# EAGLE design Xenon_Light (EAGLE 8.0.1)
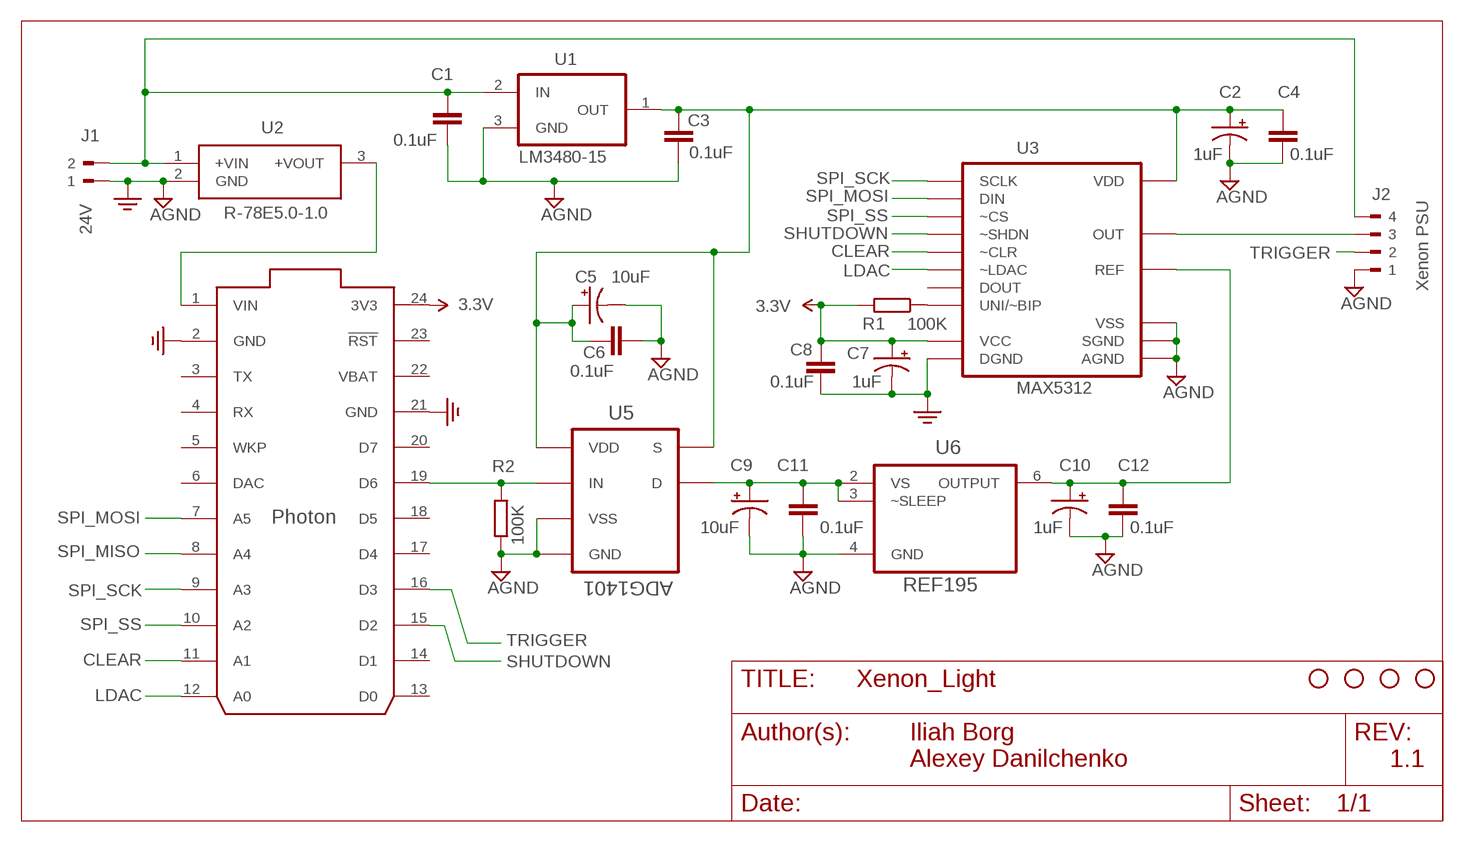
[diagram p0: schematic, sheet 1]

## Parts
C1  0.1uF  C-EUC0805  [C0805]
C2  1uF  TANT-CAP1206  [EIA3216]
C3  0.1uF  C-EUC0805  [C0805]
C4  0.1uF  C-EUC0805  [C0805]
C5  10uF  TANT-CAP1206  [EIA3216]
C6  0.1uF  C-EUC0805  [C0805]
C7  1uF  TANT-CAP1206  [EIA3216]
C8  0.1uF  C-EUC0805  [C0805]
C9  10uF  TANT-CAP1206  [EIA3216]
C10  1uF  TANT-CAP1206  [EIA3216]
C11  0.1uF  C-EUC0805  [C0805]
C12  0.1uF  C-EUC0805  [C0805]
J1  24V  PM5.08/2/90BLK  [WEIDMULLER_PM5.08_2]
J2  Xenon PSU  TERMINAL_BLK_4  [TERMINAL_BLK_4X5MM]
R1  100K  R-EU_R0805  [R0805]
R2  100K  R-EU_R0805  [R0805]
STANDOFF1  STAND-OFF  [STAND-OFF]
STANDOFF2  STAND-OFF  [STAND-OFF]
STANDOFF3  STAND-OFF  [STAND-OFF]
STANDOFF4  STAND-OFF  [STAND-OFF]
U1  LM3480-15  LM3480  [SOT23]
U2  R-78E5.0-1.0  [R-78E5.0-1.0]
U3  MAX5312  [SSOP16]
U4  PHOTON_WITH_HEADERS  [PHOTON]
U5  ADG1401  ADG1401BRMZ  [SOP65P490X110-8N]
U6  REF195  [SOIC127P600X175-8N]

## Nets
3.3V: C7.A(+) C8.2 R1.2 U3.6(VCC) U4.24(3V3)
15V: C9.A(+) C11.2 U5.8(D) U6.2(VS) U6.3(~SLEEP)
CLEAR: U3.15(~CLR) U4.11(A1)
GND: C1.1 C2.C(-) C3.1 C4.1 C5.C(-) C6.1 C7.C(-) C8.1 C9.C(-) C10.C(-) C11.1 C12.1 J1.1 J2.1 R2.1 U1.3(GND) U2.2(GND) U3.5(DGND) U3.10(SGND) U3.11(AGND) U3.12(VSS) U4.2(GND) U4.21(GND) U5.3(GND) U5.7(VSS) U6.4(GND) ; supply symbol labelled AGND
LDAC: U3.16(~LDAC) U4.12(A0)
N$1: C1.2 J1.2 J2.4 U1.2(IN) U2.1(+VIN)
N$2: U2.3(+VOUT) U4.1(VIN)
N$3: R2.2 U4.19(D6) U5.6(IN)
N$5: R1.1 U3.8(UNI/~BIP)
N$6: J2.3 U3.9(OUT)
REF: C10.A(+) C12.2 U3.13(REF) U6.6(OUTPUT)
SHUTDOWN: U3.7(~SHDN) U4.15(D2)
SPI_MISO: U4.8(A4)
SPI_MOSI: U3.2(DIN) U4.7(A5)
SPI_SCK: U3.1(SCLK) U4.9(A3)
SPI_SS: U3.3(~CS) U4.10(A2)
TRIGGER: J2.2 U4.16(D3)
V15V: C2.A(+) C3.2 C4.2 C5.A(+) C6.2 U1.1(OUT) U3.14(VDD) U5.1(S) U5.4(VDD)
Unconnected: U3.4(DOUT) U4.3(TX) U4.4(RX) U4.5(WKP) U4.6(DAC) U4.13(D0) U4.14(D1) U4.17(D4) U4.18(D5) U4.20(D7) U4.23(!RST)

## Notes on the sheet
- Iliah Borg
  Alexey Danilchenko
- 1.1

## Power pins joined to a net without a drawn wire
VBAT: U4.22(VBAT)

## Library data of the parts
C1 C3 C4 C6 C8 C11 C12 = resistor:C-EU: CAPACITOR, European symbol
C2 C7 C10 = Spectron:TANT-CAP: Tantalum SMT
C5 C9 = Spectron2:TANT-CAP: Tantalum SMT
J1 = WEIDMULLER-PM5.08_2_90BLK:PM5.08/2/90BLK: TERMINAL BLOCK, SIDE ENTRY, 2WAY; MPN: PM5.08/2/90 BLK; OC_FARNELL: 1131855; OC_NEWARK: 26M1980; PACKAGE: TH-R/A; SUPPLIER: WEIDMULLER
J2 = WEIDMULLER-PM5.08_2_90BLK:TERMINAL_BLK_4: TERMINAL BLOCK, SIDE ENTRY, 2WAY
R1 R2 = rcl:R-EU_: RESISTOR, European symbol
STANDOFF1-STANDOFF4 = Spectron2:STAND-OFF: #4 Stand Off This is the mechanical footprint for a #4 phillips button head screw. Use the keepout ring to avoid running the screw head into surrounding components. SKU : PRT-00447
U1 = Misc:LM3480: 100 mA Low Dropout Linear Voltage Regulator
U2 = Xenon:R-78E5.0-1.0: Non-Isolated DC/DC Converters 8-28Vin 5V 1.0A THRU Source: Datasheet <http://www.recom-power.com/pdf/Innoline/R-78Exx-1.0.pdf>; ARROW_PART_NUMBER: R-78E5.0-1.0; ARROW_PRICE/STOCK: https://www.arrow.com/en/products/r-78e5.0-1.0/recom-power; DESCRIPTION: Non-Isolated DC/DC Converters 8-28Vin 5V 1.0A THRU; HEIGHT: mm; MANUFACTURER_NAME: RECOM Power; MANUFACTURER_PART_NUMBER: R-78E5.0-1.0; RS_PART_NUMBER: 1446290; RS_PRICE/STOCK: http://uk.rs-online.com/web/p/products/1446290
U3 = Xenon:MAX5312: Maxim MAX5312 DAC The MAX5312 12-bit, serial interface, digital-to-analog converter (DAC) provides bipolar +/-5V to +/-10V outputs from +/-12V to +/-15V power supply voltages, or a unipolar 5V to 10V output from a single 12V to 15V power supply voltage.
U4 = Spectron2:PHOTON
U5 = Analog Devices_By_element14_Batch_1:ADG1401BRMZ: SPST Switches; MPN: ADG1401BRMZ; OC_FARNELL: 1786219; OC_NEWARK: 52R8027; PACKAGE: MSOP-8; SUPPLIER: Analog Devices
U6 = ADI-REF19xx:REF195: Precision Micropower, Low Dropout Voltage References; MPN: REF195; OC_FARNELL: -; OC_NEWARK: 19M9005; PACKAGE: SOIC-8; SUPPLIER: ANALOG DEVICES

## Board
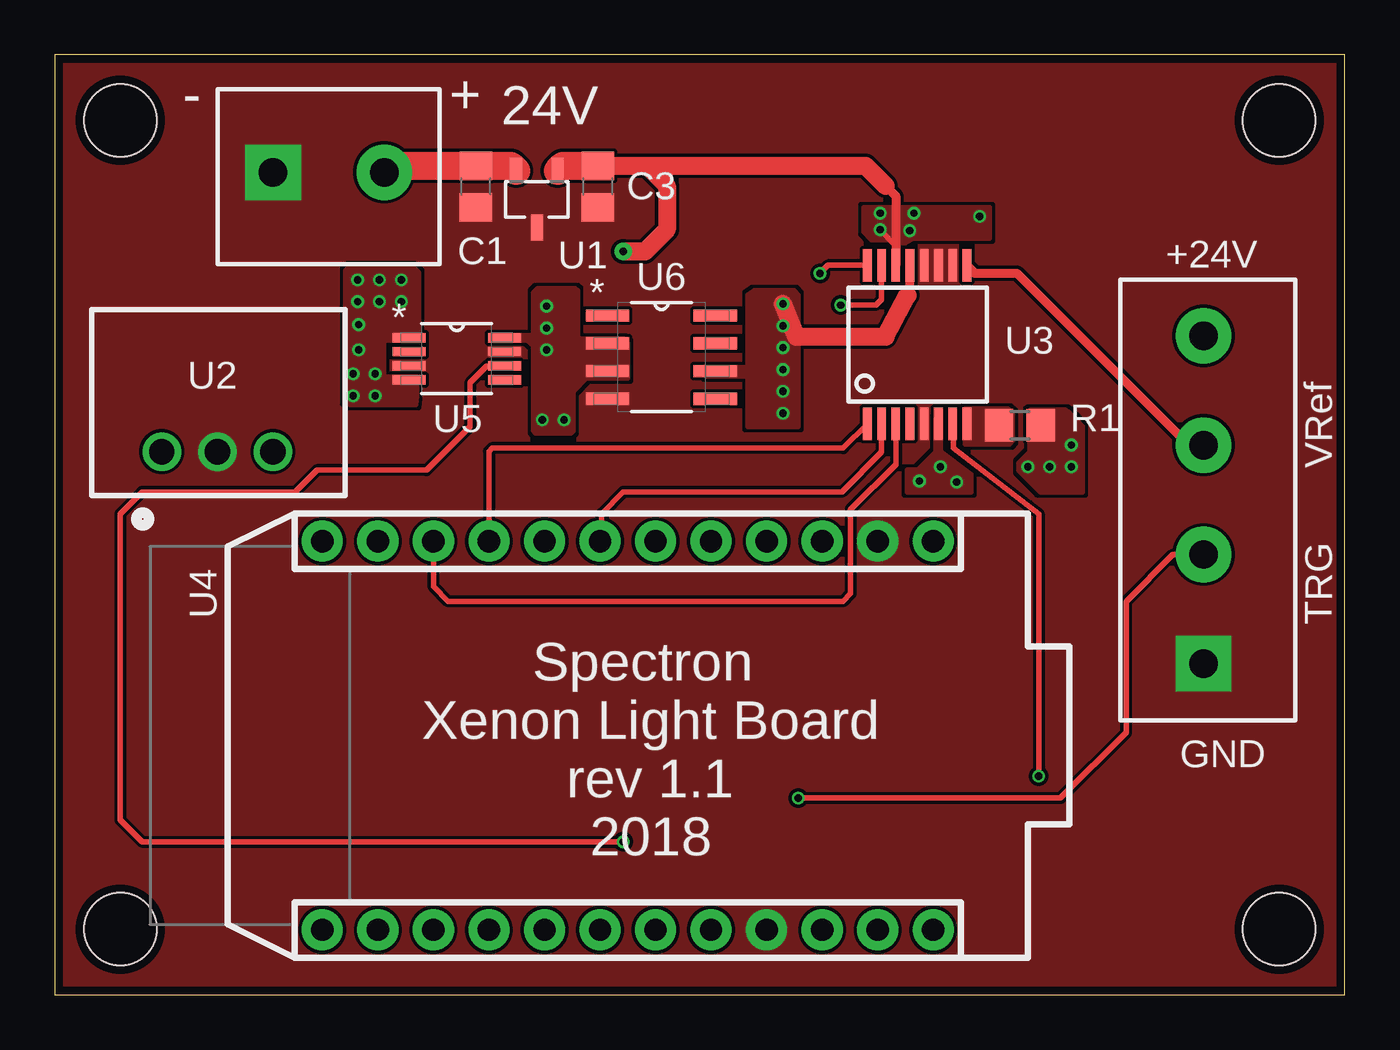
[diagram p1: board, top side]
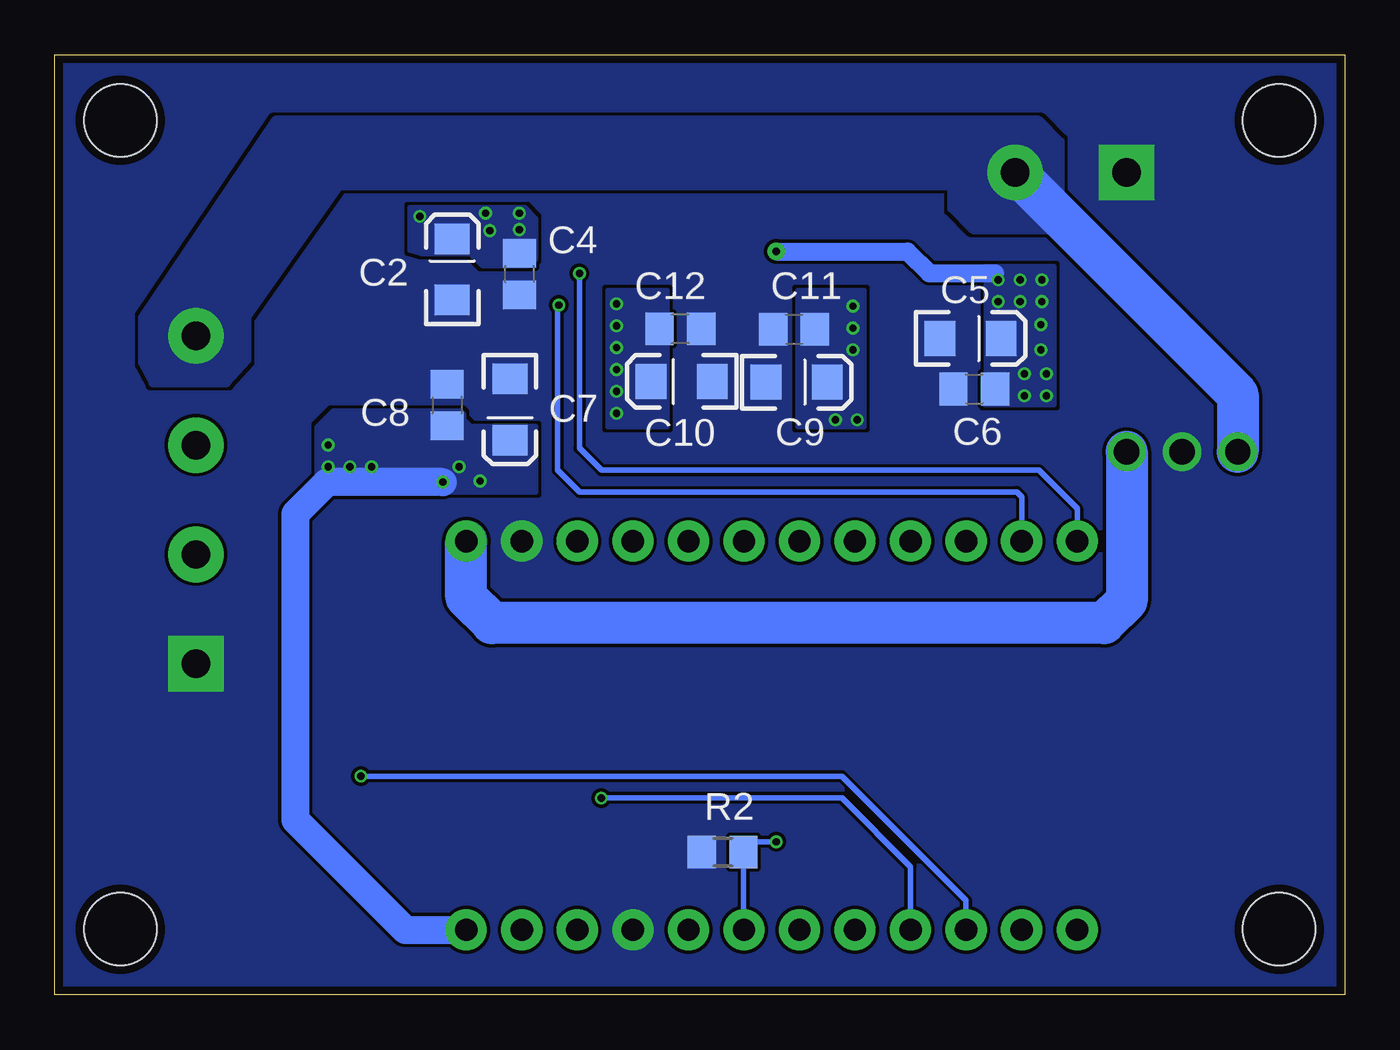
[diagram p2: board, bottom side, seen from below]

Size 59 x 43 mm. Coordinates in mm from the lower left corner, seen from the top.
Outline: 0,0 59,0 59,43 0,43 0,0
Copper layers (1*16): Top 0.035559375mm / dielectric 1.6mm / Bottom 0.035559375mm
Design rules "oshpark-2layer": minimum track width 6mil, minimum drill 10mil, track to track 6mil, track to pad 6mil, pad to pad 6mil, via to via 6mil, smd to smd 6mil, copper to edge 15mil, drill to drill 6mil, minimum pad ring 5mil, minimum via ring 5mil, stop-mask expansion 2.5mil, vias tented up to drill 0mil, thermal gap 10mil

### Footprints (pad centres in the part's own frame; a part is rotated, then mirrored left to right if it is on the bottom)
C0805 = smd 1.3 x 1.5: 1 -0.95,0; 2 0.95,0
EIA3216 = smd 1.4 x 1.6: A 1.4,0; C -1.4,0
WEIDMULLER_PM5.08_2 = drill 1.3 pad 2.54 square: 1 -2.54,0 | drill 1.3 pad 2.54: 2 2.54,0
TERMINAL_BLK_4X5MM = drill 1.3 pad 2.54 square: 1 -2.5,0 | drill 1.3 pad 2.54: 2 2.5,0; 3 7.5,0; 4 12.5,0
R0805 = smd 1.3 x 1.5: 1 -0.95,0; 2 0.95,0
STAND-OFF = hole 3.302: 0,0
SOT23 = smd 0.55 x 1.2: 1 0.95,1.3; 2 -0.95,1.3; 3 0,-1.3
R-78E5.0-1.0 = drill 1.15 pad 1.75: 1 3.21,2; 2 5.75,2; 3 8.29,2
SSOP16 = smd 1.5 x 0.4: 1 -3.625,2.925; 2 -3.625,2.275; 3 -3.625,1.625; 4 -3.625,0.975; 5 -3.625,0.325; 6 -3.625,-0.325; 7 -3.625,-0.975; 8 -3.625,-1.625; 9 3.625,-1.625; 10 3.625,-0.975; 11 3.625,-0.325; 12 3.625,0.325; 13 3.625,0.975; 14 3.625,1.625; 15 3.625,2.275; 16 3.625,2.925
PHOTON = drill 1.016 pad 1.88: 1 1.27,32.258; 2 1.27,29.718; 3 1.27,27.178; 4 1.27,24.638; 5 1.27,22.098; 6 1.27,19.558; 7 1.27,17.018; 8 1.27,14.478; 9 1.27,11.938; 10 1.27,9.398; 11 1.27,6.858; 12 1.27,4.318; 13 19.05,4.318; 14 19.05,6.858; 15 19.05,9.398; 16 19.05,11.938; 17 19.05,14.478; 18 19.05,17.018; 19 19.05,19.558; 20 19.05,22.098; 21 19.05,24.638; 22 19.05,27.178; 23 19.05,29.718; 24 19.05,32.258
SOP65P490X110-8N = smd 1.499 x 0.432: 1 -2.184,0.965; 2 -2.184,0.33; 3 -2.184,-0.33; 4 -2.184,-0.965; 5 2.184,-0.965; 6 2.184,-0.33; 7 2.184,0.33; 8 2.184,0.965
SOIC127P600X175-8N = smd 1.981 x 0.559: 1 -2.464,1.905; 2 -2.464,0.635; 3 -2.464,-0.635; 4 -2.464,-1.905; 5 2.464,-1.905; 6 2.464,-0.635; 7 2.464,0.635; 8 2.464,1.905

### Placement (x,y rotation side)
C1  19.26,36.97 90 top
C2  40.82,33.18 90 bottom
C3  24.84,36.97 90 top
C4  37.74,32.97 90 bottom
C5  17.12,30.02 0 bottom
C6  16.95,27.71 0 bottom
C7  38.18,26.77 270 bottom
C8  41.06,26.97 270 bottom
C9  25.07,28.02 0 bottom
C10  30.33,28.05 180 bottom
C11  25.19,30.44 0 bottom
C12  30.39,30.46 180 bottom
J1  12.53,37.62 0 top
J2  52.54,17.64 90 top
R1  44.13,26.05 0 top
R2  28.45,6.53 0 bottom
STANDOFF1  3,3 0 top
STANDOFF2  3,40 0 top
STANDOFF3  56,40 0 top
STANDOFF4  56,3 0 top
U1  22.05,36.39 0 top
U2  1.69,22.84 0 top
U3  40.09,29.74 90 top
U4  7.92,22.02 270 top
U5  18.39,29.09 0 top
U6  27.75,29.16 0 top

### Tracks (layer width: path | path; a pad name or v marks a point on that pad's centre or on a via)
3.3V  (via drill 0.33 pad 0.25)
  Bottom 1.27: v41.25,23.45 46.55,23.45 48,22 48,8 42.97,2.97 U4.24
  other vias: 40.5,24.15 39.55,23.5 46.5,24.15 46.5,25.15 45.5,24.15 44.5,24.15
  pour Bottom (no thermals): 37,26 40,26 40.3,26.3 40.3,26.55 40.45,26.7 46.25,26.7 47,25.95 47,23.3 46.7,23 37,23
  pour Top (no thermals): 40.3,26.35 40.3,24.8 39.5,24 39,24 39,23 41.9,23 41.9,23.8 40.5,24.85 40.5,26.35
  pour Top (no thermals): 44.5,26.65 44.6,26.55 44.6,24.8 44.1,24.3 44.1,24 45.1,23 47,23 47,26 46.35,26.65 46.3,26.65 46.25,26.7 46.2,26.75 44.75,26.75 44.65,26.75 44.55,26.65
15V  (via drill 0.33 pad 0.25)
  other vias: 22.5,31.5 22.5,30.5 22.5,29.5 22.3,26.3 23.3,26.3
  pour Bottom (no thermals): 25,32.2 25,26 22,26 22,32.2
  pour Top (no thermals): 20.4,30.15 21.9,30.15 21.9,32.1 22.1,32.3 23.8,32.3 23.9,32.2 23.9,30.1 24,30 26,30 26.2,29.8 26.2,28.2 24.3,28.2 23.7,27.6 23.7,25.8 23.6,25.7 22,25.7 21.9,25.8 21.9,29.7 21.6,29.95 20.4,29.95
CLEAR  (via drill 0.33 pad 0.25)
  Top 0.254: U3.15 37.8,33.35 37.8,31.8 37.55,31.55 v35.95,31.55
  Bottom 0.254: v35.95,31.55 36,31.5 36,24 35,23 15,23 14.78,22.78 U4.11
GND
  pour Bottom (rank 6, no thermals): 0,0 0,43 59,43 59,0
  pour Top (rank 6, no thermals): 0,0 0,43 59,43 59,0
LDAC  (via drill 0.33 pad 0.25)
  Top 0.254: U3.16 35.37,33.37 v35,33
  Bottom 0.254: v35,33 35,25 34,24 14,24 12.24,22.24 U4.12
N$1
  Top 1.27: J1.2 15.37,37.92 C1.2 20.87,37.92 U1.2
  Bottom 1.93: J1.2 4.9,27.45 U2.1
  pour Bottom (no thermals): 13,36 13,39 14,40 48.9,40 55,30.95 55,28.95 54.5,28 51.15,28 50.2,29.05 50.2,31.05 46,37 18,37 18,36 17,35 13.6,35
N$2
  Bottom 1.93: U2.3 9.98,18.02 11,17 39,17 40.18,18.18 U4.1
N$3  (via drill 0.33 pad 0.25)
  Top 0.254: U5.6 19.76,28.76 19,28 19,26 17,24 12,24 11,23 4,23 3,22 3,8 4,7 v26,7
  Bottom 0.254: U4.19 27.5,2.99 R2.2 27.03,7 v26,7
N$5
  pour Top (no thermals): 41.65,25.2 41.65,26.8 43.6,26.8 43.8,26.6 43.8,25.35 43.65,25.2
N$6
  Top 0.406: U3.9 42.08,33 44,33 51.86,25.14 J2.3
REF  (via drill 0.33 pad 0.25)
  Top 0.406: 39,32 39.12,32.12 U3.13
  Top 0.813: v33.3,31.6 33.9,30.1 38,30.1 39,32
  other vias: 33.3,30.6 33.3,29.6 33.3,28.6 33.3,27.6 33.3,26.6
  pour Bottom (no thermals): 31,32.2 31,26 33.7,26 33.7,32.2
  pour Top (no thermals): 29.8,28.7 31.7,28.7 31.7,32 32,32.2 33.8,32.2 34,32 34,26 31.7,26 31.7,28.3 29.8,28.3
SHUTDOWN  (via drill 0.33 pad 0.25)
  Top 0.254: v45,10 45,22 41.1,25 41.1,26.05 U3.7
  Bottom 0.254: U4.15 17.32,4.32 23,10 v45,10
SPI_MOSI
  Top 0.254: U3.2 37.81,24.82 36,23 26,23 25,22 25,20.81 U4.7
SPI_SCK
  Top 0.254: U3.1 36.05,25 20,25 19.86,24.86 U4.9
SPI_SS
  Top 0.254: U3.3 38.47,24.27 36.4,22.2 36.4,18.35 36.05,18 18,18 17.32,18.68 U4.10
TRIGGER  (via drill 0.33 pad 0.25)
  Top 0.254: v34,9 46,9 49,12 49,18 51.14,20.14 J2.2
  Bottom 0.254: U4.16 19.86,5.86 23,9 v34,9
V15V  (via drill 0.33 pad 0.25, 0.33 pad 0.81)
  Top 0.254: U3.14 38.47,34.23 v37.75,35
  Top 0.406: 38,37 38.47,36.53 U3.14
  Top 0.813: 38,37 37.08,37.92 C3.2 27.08,37.92 28,37 28,35 27,34 v26,34
  Top 1.27: U1.1 23.23,37.92 C3.2
  Bottom 0.813: v26,34 20,34 19,33 16,33 | 16,30.3 C5.A
  other vias: 14.85,32.7 15.85,32.7 14.85,31.7 15.85,31.7 14.65,28.4 14.65,27.4 13.85,32.7 13.85,31.7 13.65,28.4 13.65,27.4 13.9,29.5 13.9,30.65 39.3,35.75 37.75,35.75 42.3,35.6 39.1,34.95
  pour Bottom (no thermals): 16.45,27 13.3,27 13.3,33.3 16.45,33.3 16.4,32.6 16.4,27.4
  pour Top (no thermals): 16.55,28.25 16.55,27.4 16.5,27 13.5,27 13.3,27.15 13.3,33.1 13.5,33.3 16.35,33.3 16.65,33 16.65,30.2 16.4,29.95 15.15,29.95 15.05,29.85 15.05,28.35 15.15,28.25
  pour Bottom (no thermals): 37,33.7 37,35.5 37.5,36 42.75,36 42.75,34.05 42.2,33.9 39.95,33.9 39.4,33.35 37.35,33.35
  pour Top (no thermals): 37,36 42.75,36 42.75,34.6 39.3,34.6 38.9,34.4 38.35,34.4 38.2,34.55 37.35,34.55 37,34.9

### Text on the board
tNames: - | + | 24V | +24V | VRef | TRG | Spectron / Xenon Light Board / rev 1.1 / 2018 | GND